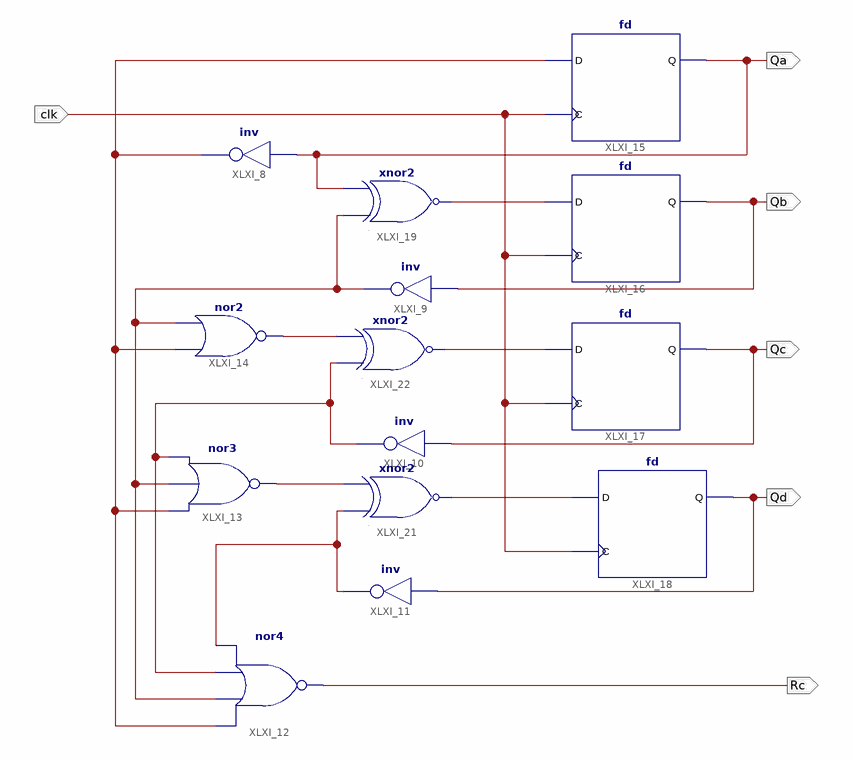
[diagram p0: schematic sheet 1]
// Xilinx ISE schematic Counter_4bit.sch (kintex7) as structural Verilog: 14 symbols, 6 ports
module Counter_4bit (
  input  clk,
  output Qa,
  output Qc,
  output Qd,
  output Qb,
  output Rc
);

  wire XLXN_2, XLXN_3, XLXN_4, XLXN_13, XLXN_15, XLXN_17, XLXN_19, XLXN_20, XLXN_22;

  not XLXI_8 (XLXN_13, Qa);
  not XLXI_9 (XLXN_22, Qb);
  not XLXI_10 (XLXN_15, Qc);
  not XLXI_11 (XLXN_17, Qd);
  nor XLXI_12 (Rc, XLXN_13, XLXN_22, XLXN_15, XLXN_17);
  nor XLXI_13 (XLXN_19, XLXN_13, XLXN_22, XLXN_15);
  nor XLXI_14 (XLXN_20, XLXN_13, XLXN_22);
  fd XLXI_15 (.C(clk), .D(XLXN_13), .Q(Qa));
  fd XLXI_16 (.C(clk), .D(XLXN_2), .Q(Qb));
  fd XLXI_17 (.C(clk), .D(XLXN_3), .Q(Qc));
  fd XLXI_18 (.C(clk), .D(XLXN_4), .Q(Qd));
  xnor XLXI_19 (XLXN_2, XLXN_22, Qa);
  xnor XLXI_21 (XLXN_4, XLXN_17, XLXN_19);
  xnor XLXI_22 (XLXN_3, XLXN_15, XLXN_20);
endmodule
